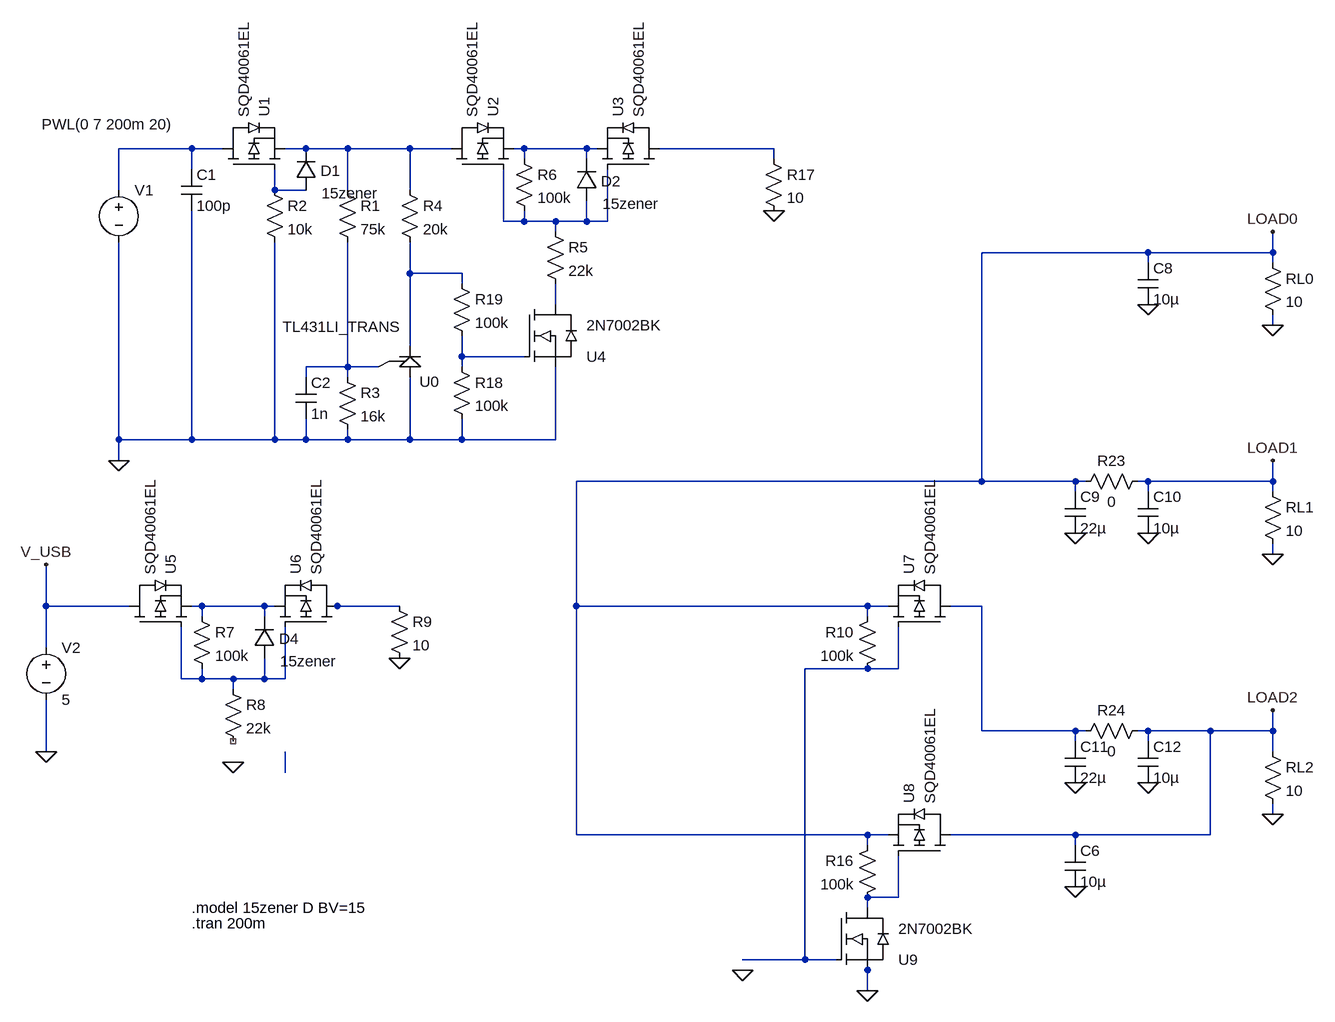
[diagram p0: schematic power_protection.asc]
power_protection.asc, the LTspice schematic file:
Version 4
SHEET 1 2212 680
WIRE 16 -976 -96 -976
WIRE 64 -976 16 -976
WIRE 192 -976 160 -976
WIRE 256 -976 192 -976
WIRE 352 -976 256 -976
WIRE 416 -976 352 -976
WIRE 528 -976 512 -976
WIRE 624 -976 528 -976
WIRE 640 -976 624 -976
WIRE 912 -976 736 -976
WIRE 528 -960 528 -976
WIRE 624 -960 624 -976
WIRE 912 -960 912 -976
WIRE 16 -944 16 -976
WIRE -96 -912 -96 -976
WIRE 144 -912 144 -944
WIRE 192 -912 144 -912
WIRE 256 -912 256 -976
WIRE 352 -912 352 -976
WIRE 496 -864 496 -944
WIRE 528 -864 528 -880
WIRE 528 -864 496 -864
WIRE 576 -864 528 -864
WIRE 624 -864 624 -896
WIRE 624 -864 576 -864
WIRE 656 -864 656 -944
WIRE 656 -864 624 -864
WIRE 576 -848 576 -864
WIRE 1488 -816 1232 -816
WIRE 1680 -816 1680 -848
WIRE 1680 -816 1488 -816
WIRE 1488 -800 1488 -816
WIRE 1680 -800 1680 -816
WIRE 352 -784 352 -832
WIRE 432 -784 352 -784
WIRE 432 -768 432 -784
WIRE 576 -736 576 -768
WIRE 1680 -704 1680 -720
WIRE 352 -672 352 -784
WIRE 432 -656 432 -688
WIRE 528 -656 432 -656
WIRE 256 -640 256 -832
WIRE 256 -640 192 -640
WIRE 304 -640 256 -640
WIRE 432 -640 432 -656
WIRE 192 -624 192 -640
WIRE 256 -624 256 -640
WIRE -96 -528 -96 -832
WIRE 16 -528 16 -880
WIRE 16 -528 -96 -528
WIRE 144 -528 144 -832
WIRE 144 -528 16 -528
WIRE 192 -528 192 -560
WIRE 192 -528 144 -528
WIRE 256 -528 256 -544
WIRE 256 -528 192 -528
WIRE 352 -528 352 -624
WIRE 352 -528 256 -528
WIRE 432 -528 432 -560
WIRE 432 -528 352 -528
WIRE 576 -528 576 -640
WIRE 576 -528 432 -528
WIRE -96 -496 -96 -528
WIRE 1232 -464 1232 -816
WIRE 1232 -464 608 -464
WIRE 1376 -464 1232 -464
WIRE 1392 -464 1376 -464
WIRE 1488 -464 1472 -464
WIRE 1680 -464 1680 -496
WIRE 1680 -464 1488 -464
WIRE 1376 -448 1376 -464
WIRE 1488 -448 1488 -464
WIRE 1680 -448 1680 -464
WIRE 1680 -352 1680 -368
WIRE -208 -272 -208 -336
WIRE -80 -272 -208 -272
WIRE 32 -272 16 -272
WIRE 128 -272 32 -272
WIRE 144 -272 128 -272
WIRE 240 -272 224 -272
WIRE 336 -272 240 -272
WIRE 608 -272 608 -464
WIRE 1056 -272 608 -272
WIRE 1088 -272 1056 -272
WIRE 1232 -272 1184 -272
WIRE 32 -256 32 -272
WIRE 128 -256 128 -272
WIRE 1056 -256 1056 -272
WIRE -208 -208 -208 -272
WIRE 1056 -176 960 -176
WIRE 1104 -176 1104 -240
WIRE 1104 -176 1056 -176
WIRE 0 -160 0 -240
WIRE 32 -160 32 -176
WIRE 32 -160 0 -160
WIRE 80 -160 32 -160
WIRE 128 -160 128 -192
WIRE 128 -160 80 -160
WIRE 160 -160 160 -240
WIRE 160 -160 128 -160
WIRE 80 -144 80 -160
WIRE 1232 -80 1232 -272
WIRE 1376 -80 1232 -80
WIRE 1392 -80 1376 -80
WIRE 1488 -80 1472 -80
WIRE 1584 -80 1488 -80
WIRE 1680 -80 1680 -112
WIRE 1680 -80 1584 -80
WIRE 1376 -64 1376 -80
WIRE 1488 -64 1488 -80
WIRE -208 -48 -208 -128
WIRE 1680 -48 1680 -80
WIRE 160 -16 160 -48
WIRE 1680 48 1680 32
WIRE 608 80 608 -272
WIRE 1056 80 608 80
WIRE 1088 80 1056 80
WIRE 1376 80 1184 80
WIRE 1584 80 1584 -80
WIRE 1584 80 1376 80
WIRE 1056 96 1056 80
WIRE 1376 96 1376 80
WIRE 1104 176 1104 112
WIRE 1104 176 1056 176
WIRE 1056 192 1056 176
WIRE 960 272 960 -176
WIRE 960 272 864 272
WIRE 1008 272 960 272
WIRE 1056 288 1056 272
WIRE 1056 320 1056 288
FLAG -96 -496 0
FLAG 1680 -704 0
FLAG -208 -48 0
FLAG 1488 -736 0
FLAG 1680 -352 0
FLAG 1376 -384 0
FLAG 1488 -384 0
FLAG 1680 48 0
FLAG 1376 0 0
FLAG 1488 0 0
FLAG 1680 -848 LOAD0
FLAG 1680 -496 LOAD1
FLAG 1680 -112 LOAD2
FLAG -208 -336 V_USB
FLAG 1056 320 0
FLAG 80 -32 0
FLAG 1376 160 0
FLAG 912 -880 0
FLAG 864 288 0
FLAG 336 -192 0
SYMBOL voltage -96 -928 R0
WINDOW 123 0 0 Left 0
WINDOW 39 0 0 Left 0
WINDOW 3 -119 -85 Left 2
SYMATTR Value PWL(0 7 200m 20)
SYMATTR InstName V1
SYMBOL res 240 -928 R0
SYMATTR InstName R1
SYMATTR Value 75k
SYMBOL res 240 -640 R0
SYMATTR InstName R3
SYMATTR Value 16k
SYMBOL cap 176 -624 R0
SYMATTR InstName C2
SYMATTR Value 1n
SYMBOL res 560 -864 R0
SYMATTR InstName R5
SYMATTR Value 22k
SYMBOL res 512 -976 R0
SYMATTR InstName R6
SYMATTR Value 100k
SYMBOL res 1664 -816 R0
SYMATTR InstName RL0
SYMATTR Value 10
SYMBOL res 64 -160 R0
SYMATTR InstName R8
SYMATTR Value 22k
SYMBOL voltage -208 -224 R0
WINDOW 123 0 0 Left 0
WINDOW 39 0 0 Left 0
SYMATTR InstName V2
SYMATTR Value 5
SYMBOL cap 1472 -800 R0
SYMATTR InstName C8
SYMATTR Value 10µ
SYMBOL res 1664 -464 R0
SYMATTR InstName RL1
SYMATTR Value 10
SYMBOL cap 1360 -448 R0
SYMATTR InstName C9
SYMATTR Value 22µ
SYMBOL res 1488 -480 R90
WINDOW 0 0 56 VBottom 2
WINDOW 3 32 56 VTop 2
SYMATTR InstName R23
SYMATTR Value 0
SYMBOL cap 1472 -448 R0
SYMATTR InstName C10
SYMATTR Value 10µ
SYMBOL res 1664 -64 R0
SYMATTR InstName RL2
SYMATTR Value 10
SYMBOL cap 1360 -64 R0
SYMATTR InstName C11
SYMATTR Value 22µ
SYMBOL res 1488 -96 R90
WINDOW 0 0 56 VBottom 2
WINDOW 3 32 56 VTop 2
SYMATTR InstName R24
SYMATTR Value 0
SYMBOL cap 1472 -64 R0
SYMATTR InstName C12
SYMATTR Value 10µ
SYMBOL res 1072 -272 M0
SYMATTR InstName R10
SYMATTR Value 100k
SYMBOL AutoGenerated\\2N7002BK 1008 192 R0
SYMATTR InstName U9
SYMBOL res 1072 80 M0
SYMATTR InstName R16
SYMATTR Value 100k
SYMBOL cap 1360 96 R0
SYMATTR InstName C6
SYMATTR Value 10µ
SYMBOL res 336 -928 R0
SYMATTR InstName R4
SYMATTR Value 20k
SYMBOL AutoGenerated\\TL431LI_TRANS 352 -656 R0
WINDOW 0 15 39 Left 2
WINDOW 3 -196 -46 Left 2
SYMATTR InstName U0
SYMBOL res 416 -656 R0
SYMATTR InstName R18
SYMATTR Value 100k
SYMBOL AutoGenerated\\2N7002BK 528 -736 R0
SYMATTR InstName U4
SYMBOL res 416 -784 R0
SYMATTR InstName R19
SYMATTR Value 100k
SYMBOL res 896 -976 R0
SYMATTR InstName R17
SYMATTR Value 10
SYMBOL res 128 -928 R0
SYMATTR InstName R2
SYMATTR Value 10k
SYMBOL cap 0 -944 R0
SYMATTR InstName C1
SYMATTR Value 100p
SYMBOL AutoGenerated\\SQD40061EL 752 -944 M270
SYMATTR InstName U3
SYMBOL res 16 -272 R0
SYMATTR InstName R7
SYMATTR Value 100k
SYMBOL AutoGenerated\\SQD40061EL 256 -240 M270
SYMATTR InstName U6
SYMBOL AutoGenerated\\SQD40061EL -96 -240 R270
SYMATTR InstName U5
SYMBOL AutoGenerated\\SQD40061EL 1200 -240 M270
SYMATTR InstName U7
SYMBOL AutoGenerated\\SQD40061EL 1200 112 M270
SYMATTR InstName U8
SYMBOL diode 144 -192 R180
WINDOW 0 -37 30 Left 2
WINDOW 3 -96 -5 Left 2
SYMATTR InstName D4
SYMATTR Value 15zener
SYMBOL AutoGenerated\\SQD40061EL 48 -944 R270
SYMATTR InstName U1
SYMBOL diode 208 -912 R180
WINDOW 0 -37 30 Left 2
WINDOW 3 -96 -5 Left 2
SYMATTR InstName D1
SYMATTR Value 15zener
SYMBOL diode 640 -896 R180
WINDOW 0 -37 30 Left 2
WINDOW 3 -96 -5 Left 2
SYMATTR InstName D2
SYMATTR Value 15zener
SYMBOL AutoGenerated\\SQD40061EL 400 -944 R270
SYMATTR InstName U2
SYMBOL res 320 -288 R0
SYMATTR InstName R9
SYMATTR Value 10
TEXT 16 216 Left 2 !.tran 200m
TEXT 16 192 Left 2 !.model 15zener D BV=15

The netlist it stands for:
* power_protection.asc
V1 N001 0 PWL(0 7 200m 20)
R1 N002 N010 75k
R3 N010 0 16k
C2 N010 0 1n
R5 N006 N008 22k
R6 N003 N006 100k
RL0 LOAD0 0 10
R8 N015 NC_01 22k
V2 V_USB 0 5
C8 LOAD0 0 10µ
RL1 LOAD1 0 10
C9 LOAD0 0 22µ
R23 LOAD1 LOAD0 0
C10 LOAD1 0 10µ
RL2 LOAD2 0 10
C11 N013 0 22µ
R24 LOAD2 N013 0
C12 LOAD2 0 10µ
R10 LOAD0 N014 100k
XU9 N017 N014 0 2N7002BK  ; pins DRAIN GATE SOURCE
R16 LOAD0 N017 100k
C6 LOAD2 0 10µ
R4 N002 N007 20k
XU0 N007 N010 0 TL431LI_TRANS  ; pins CATHODE REF ANODE
R18 N009 0 100k
XU4 N008 N009 0 2N7002BK  ; pins DRAIN GATE SOURCE
R19 N007 N009 100k
R17 N004 0 10
R2 N005 0 10k
C1 N001 0 100p
XU3 N004 N006 N003 SQD40061EL  ; pins D G S
R7 N011 N015 100k
XU6 N012 N015 N011 SQD40061EL  ; pins D G S
XU5 V_USB N015 N011 SQD40061EL  ; pins D G S
XU7 N013 N014 LOAD0 SQD40061EL  ; pins D G S
XU8 LOAD2 N017 LOAD0 SQD40061EL  ; pins D G S
D4 N015 N011 15zener
XU1 N001 N005 N002 SQD40061EL  ; pins D G S
D1 N005 N002 15zener
D2 N006 N003 15zener
XU2 N002 N006 N003 SQD40061EL  ; pins D G S
R9 N012 0 10
.model D D
.lib standard.dio
.tran 200m
.model 15zener D BV=15
.lib C:\Users\Filip.Filip\Documents\VST104\SpiceSimulations\LTSpiceModels\2N7002BK.lib
.lib C:\Users\Filip.Filip\Documents\VST104\SpiceSimulations\LTSpiceModels\TL431LI_TRANS.LIB
.lib C:\Users\Filip.Filip\Documents\VST104\SpiceSimulations\LTSpiceModels\SQD40061EL_PS.LIB
.backanno
.end